# EAGLE design Teaching_instrument_mother_board_v4 (EAGLE 9.6.2)
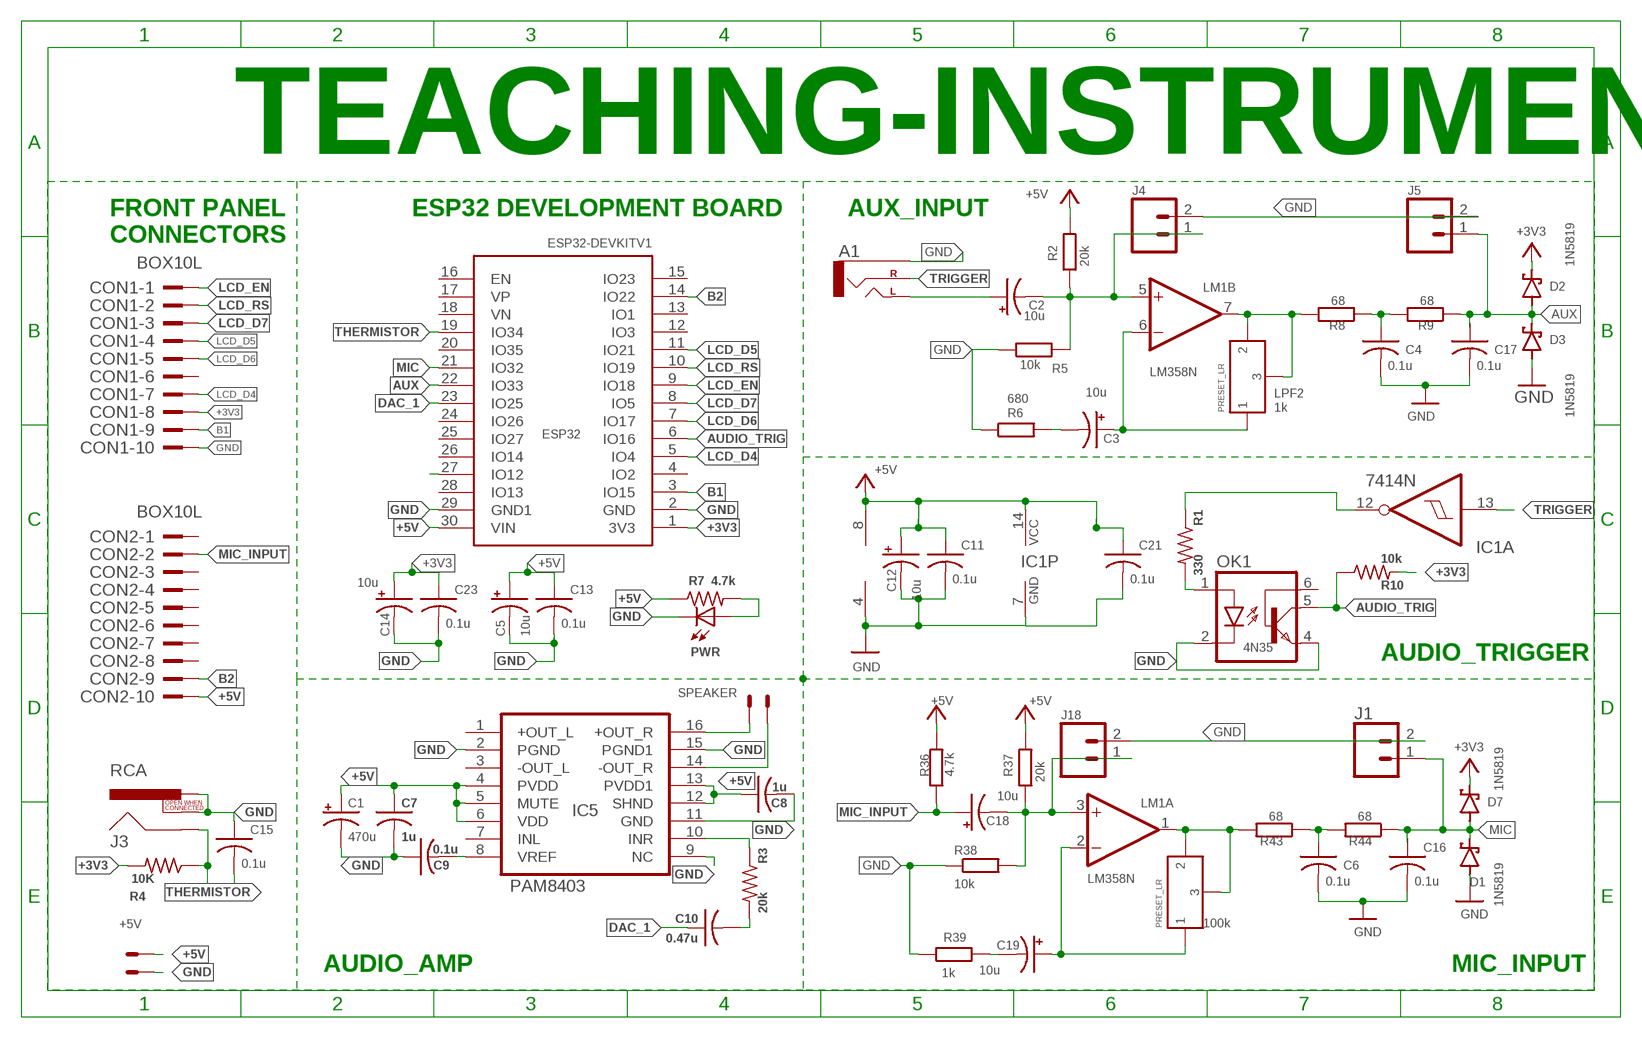
[diagram p0: schematic, sheet 1]

## Parts
100K  PRESET_LR  [PRESET_LR]
A1  CEDT_JANUARY_2015_V5_AUDIO-JACKPTH  [CEDT_JANUARY_2015_V5_AUDIO-JACK]
C1  470u  CPOL-USE5-10.5  [E5-10,5]
C2  10u  CPOL-USE2.5-5  [E2,5-5]
C3  10u  CPOL-USE2.5-5  [E2,5-5]
C4  0.1u  C-US025-024X044  [C025-024X044]
C5  10u  CPOL-USE2.5-5  [E2,5-5]
C6  0.1u  C-US025-024X044  [C025-024X044]
C7  1u  CAP0805  [C0805]
C8  1u  CAP0805  [C0805]
C9  0.1u  CAP0805  [C0805]
C10  0.47u  CAP0603  [C0603]
C11  0.1u  C-US025-024X044  [C025-024X044]
C12  10u  CPOL-USE2.5-5  [E2,5-5]
C13  0.1u  C-US025-024X044  [C025-024X044]
C14  10u  CPOL-USE2.5-5  [E2,5-5]
C15  0.1u  C-US025-024X044  [C025-024X044]
C16  0.1u  C-US025-024X044  [C025-024X044]
C17  0.1u  C-US025-024X044  [C025-024X044]
C18  10u  CPOL-USE2.5-5  [E2,5-5]
C19  10u  CPOL-USE2.5-5  [E2,5-5]
C21  0.1u  C-US025-024X044  [C025-024X044]
C23  0.1u  C-US025-024X044  [C025-024X044]
CON1  BOX10L  [BOX10L]
CON2  BOX10L  [BOX10L]
D1  1N5819  1N5819-B  [DO41-7.6]
D2  1N5819  1N5819-B  [DO41-7.6]
D3  1N5819  1N5819-B  [DO41-7.6]
D7  1N5819  1N5819-B  [DO41-7.6]
ESP32  ESP32-DEVKITV1_ESP32DEVKITV1ESP32  [ESP32]
IC1  7414N  [DIL14]
IC5  PAM8403  [SOP-16]
J1  CONN_02  [1X02]
J3  RCA  [RCA]
J4  CONN_02  [1X02]
J5  CONN_02  [1X02]
J18  CONN_02  [1X02]
LM1  LM358N  [DIL08]
OK1  4N35  [DIL06]
PWR  LED3MM  [LED3MM]
R1  330  R-US_M0805  [M0805]
R2  20k  R-EU_0207/10  [0207/10]
R3  20k  R-US_0207/10  [0207/10]
R4  10K  R-US_0207/10  [0207/10]
R5  10k  R-EU_0207/10  [0207/10]
R6  680  R-EU_0207/10  [0207/10]
R7  4.7k  R-US_0207/10  [0207/10]
R8  68  R-EU_0207/10  [0207/10]
R9  68  R-EU_0207/10  [0207/10]
R10  10k  R-US_M0805  [M0805]
R36  4.7k  R-EU_0207/10  [0207/10]
R37  20k  R-EU_0207/10  [0207/10]
R38  10k  R-EU_0207/10  [0207/10]
R39  1k  R-EU_0207/10  [0207/10]
R43  68  R-EU_0207/10  [0207/10]
R44  68  R-EU_0207/10  [0207/10]
SPEAKER  SPEAKER  JST-XH-02-PIN-LONG-PAD  [JST-XH-02-PACKAGE-LONG-PAD]
U$3  PRESET_LR  [PRESET_LR]
X1  +5V  JST-XH-02-PIN-LONG-PAD  [JST-XH-02-PACKAGE-LONG-PAD]

## Nets
+3V3: C14.+ C23.1 CON1.8 D2.C D7.C ESP32.1(3V3) R4.2 R10.2
+5V [POWER]: C1.+ C5.+ C7.1 C8.1 C11.1 C12.+ C13.1 C21.1 CON2.10 ESP32.30(VIN) IC1.14(P:VCC) IC5.4(PVDD) IC5.5(MUTE) IC5.6(VDD) IC5.12(SHND) IC5.13(PVDD1) LM1.8(P:V+) R2.2 R7.1 R36.2 R37.2 X1.2
ADC_6: ESP32.27(IO12)
AUDIO_TRIG: ESP32.6(IO16) OK1.5(COL) R10.1
AUX: C17.1 D2.A D3.C ESP32.22(IO33) J5.1 R9.1
B1: CON1.9 ESP32.3(IO15)
B2: CON2.9 ESP32.14(IO22)
DAC_1: C10.1 ESP32.23(IO25)
GND: A1.SLEEVE C1.- C4.2 C5.- C6.2 C7.2 C8.2 C9.1 C11.2 C12.- C13.2 C14.- C15.1 C16.2 C17.2 C21.2 C23.2 CON1.10 D1.A D3.A ESP32.2(GND) ESP32.29(GND1) IC1.7(P:GND) IC5.2(PGND) IC5.9(NC) IC5.11(GND) IC5.15(PGND1) J1.2 J3.PIN J3.SWITCH J4.2 J5.2 J18.2 LM1.4(P:V-) OK1.2(C) OK1.4(EMI) PWR.K(C) R5.1 R6.1 R38.1 R39.1 X1.1
LCD_D4: CON1.7 ESP32.5(IO4)
LCD_D5: CON1.4 ESP32.11(IO21)
LCD_D6: CON1.5 ESP32.7(IO17)
LCD_D7: CON1.3 ESP32.8(IO5)
LCD_EN: CON1.1 ESP32.9(IO18)
LCD_RS: CON1.2 ESP32.10(IO19)
LPF1: 100K.P$2 100K.P$3 LM1.1(A:OUT) R43.2
LPF2: LM1.7(B:OUT) R8.2 U$3.P$2 U$3.P$3
MIC: C16.1 D1.C D7.A ESP32.21(IO32) J1.1 R44.1
MIC_INPUT: C18.+ CON2.2 R36.1
N$1: IC5.16(+OUT_R) SPEAKER.2
N$2: 100K.P$1 C19.+ LM1.2(A:-IN)
N$3: A1.TIP(LEFT) C2.+
N$4: OK1.1(A) R1.2
N$5: IC5.14(-OUT_R) SPEAKER.1
N$6: C3.- R6.2
N$7: C9.2 IC5.8(VREF)
N$8: C10.2 R3.2
N$9: C2.- J4.1 LM1.5(B:+IN) R2.1 R5.2
N$10: C3.+ LM1.6(B:-IN) U$3.P$1
N$11: IC1.12(A:O) R1.1
N$12: C4.1 R8.1 R9.2
N$29: IC5.10(INR) R3.1
N$34: C6.1 R43.1 R44.2
N$38: PWR.A R7.2
N$49: C19.- R39.2
THERMISTOR: C15.2 ESP32.19(IO34) J3.SHELL R4.1
TRIGGER: A1.RING(RIGHT) IC1.13(A:I)
V3: C18.- J18.1 LM1.3(A:+IN) R37.1 R38.2
Unconnected: CON1.6 CON2.1 CON2.3 CON2.4 CON2.5 CON2.6 CON2.7 CON2.8 ESP32.4(IO2) ESP32.12(IO3) ESP32.13(IO1) ESP32.15(IO23) ESP32.16(EN) ESP32.17(VP) ESP32.18(VN) ESP32.20(IO35) ESP32.24(IO26) ESP32.25(IO27) ESP32.26(IO14) ESP32.28(IO13) IC1.1(D:I) IC1.2(D:O) IC1.3(E:I) IC1.4(E:O) IC1.5(F:I) IC1.6(F:O) IC1.8(C:O) IC1.9(C:I) IC1.10(B:O) IC1.11(B:I) IC5.1(+OUT_L) IC5.3(-OUT_L) IC5.7(INL) OK1.6(BAS)

## Notes on the sheet
- TEACHING-INSTRUMENT
- ESP32 DEVELOPMENT BOARD | AUX_INPUT
- FRONT PANEL 
  CONNECTORS
- 1k
- AUDIO_TRIGGER
- 100k
- AUDIO_AMP | MIC_INPUT

## Library data of the parts
100K U$3 = CEDT_JANUARY_2015_v5:PRESET_LR
A1 = aux-connector:CEDT_JANUARY_2015_V5_AUDIO-JACK: 3.5mm Audio Jack Simple 3.5mm common PCB mount audio jack. SKU: PRT-08032
C1-C3 C5 C12 C14 C18 C19 = rcl:CPOL-US: POLARIZED CAPACITOR, American symbol; SPICEPREFIX: C
C4 C6 C11 C13 C15-C17 C21 C23 = adafruit:C-US: CAPACITOR, American symbol
C7-C10 = CEDT_JANUARY_2015_v5:CAP
CON1 CON2 = CEDT_JANUARY_2015_v5:BOX10: 3M (TM) Pak 100 4-Wall Header Source: 3M
D1-D3 D7 = diode:1N581*: 1.0A SCHOTTKY BARRIER RECTIFIER Source: http://www.diodes.com/datasheets/ds23001.pdf
ESP32 = tw_ind:ESP32-DEVKITV1_ESP32DEVKITV1
IC1 = 74xx-eu:74*14: Hex schmitt trigger INVERTER
IC5 = PAM8403:PAM8403: Dual channel audio amplifier IC - PAM8403
J1 J4 J5 J18 = SparkFun-Connectors:CONN_02: Multi connection point. Often used as Generic Header-pin footprint for 0.1 inch spaced/style header connections On any of the 0.1 inch spaced packages, you can populate with these: Break Away Headers - Straight <https://www.sparkfun.com/products/116> (PRT-00116) Break Away Male Headers - Right Angle <https://www.sparkfun.com/products/553> (PRT-00553) Female Headers <https://www.sparkfun.com/products/115> (PRT-00115) Break Away Headers - Machine Pin <https://www.sparkfun.com/products/117> (PRT-00117) Break Away Female Headers - Swiss Machine Pin <https://www.sparkfun.com/products/743> (PRT-00743) For SCREWTERMINALS and SPRING TERMINALS visit here: Screw Terimnals on SparkFun.com <https://www.sparkfun.com/search/results?term=Screw+Terminals> (5mm/3.5mm/2.54mm spacing) This device is also useful as a general connection point to wire up your design to another part of your project. Our various solder wires solder well into these plated through hole pads. Hook-Up Wire - Assortment (Stranded, 22 AWG) <https://www.sparkfun.com/products/11375> (PRT-11375) Hook-Up Wire - Assortment (Solid Core, 22 AWG) <https://www.sparkfun.com/products/11367> (PRT-11367) View the entire wire category on our website here <https://www.sparkfun.com/categories/141> Special notes: Molex polarized connector foot print use with: PRT-08233 with associated crimp pins and housings. 2.54_SCREWTERM for use with PRT-10571. 3.5mm Screw Terminal footprints for PRT-08084 5mm Screw Terminal footprints for use with PRT-08432
J3 = SparkFun-Connectors:RCA: RCA Jack connector This is a right angle RCA jack connecotr. Commonly used for video or audio. Here is the connector we sell at SparkFun: RCA Jack <https://www.sparkfun.com/products/8631> (PRT-08631) Datasheet <http://www.sparkfun.com/datasheets/Prototyping/Connectors/RCA-Jack.pdf> It is not used on any active designs, however it was used on a couple retired products: RCA Jack Breakout [RETIRED] <https://www.sparkfun.com/products/8826> (PRT-08826) SparkFun On Screen Display Breakout - MAX7456 [RETIRED] <https://www.sparkfun.com/products/9168> (BOB-09168) You may also be interested in a cable: RCA Video Cable - 6' <https://www.sparkfun.com/products/11573> (CAB-11573); PROD_ID: CONN-09081; SF_ID: PRT-08631
LM1 = CEDT_JANUARY_2015_v5:LM358: OP AMP also LM158; LM258; LM2904 Source: http://cache.national.com/ds/LM/LM158.pdf
OK1 = optocoupler:4N35: MOTOROLA OPTO COUPLER; MF: FAIRCHILD SEMICONDUCTOR; MPN: 4N35; OC_FARNELL: 1328375; OC_NEWARK: 72K9946
PWR = adafruit:LED: LED OSRAM: - CHIPLED LG R971, LG N971, LY N971, LG Q971, LY Q971, LO R971, LY R971 LH N974, LH R974 LS Q976, LO Q976, LY Q976 LO Q996 - Hyper CHIPLED LW Q18S LB Q993, LB Q99A, LB R99A - SideLED LS A670, LO A670, LY A670, LG A670, LP A670 LB A673, LV A673, LT A673, LW A673 LH A674 LY A675 LS A676, LA A676, LO A676, LY A676, LW A676 LS A679, LY A679, LG A679 - Hyper Micro SIDELED® LS Y876, LA Y876, LO Y876, LY Y876 LT Y87S - SmartLED LW L88C, LW L88S LB L89C, LB L89S, LG L890 LS L89K, LO L89K, LY L89K LS L896, LA L896, LO L896, LY L896 - TOPLED LS T670, LO T670, LY T670, LG T670, LP T670 LSG T670, LSP T670, LSY T670, LOP T670, LYG T670 LG T671, LOG T671, LSG T671 LB T673, LV T673, LT T673, LW T673 LH T674 LS T676, LA T676, LO T676, LY T676, LB T676, LH T676, LSB T676, LW T676 LB T67C, LV T67C, LT T67C, LS T67K, LO T67K, LY T67K, LW E67C LS E67B, LA E67B, LO E67B, LY E67B, LB E67C, LV E67C, LT E67C LW T67C LS T679, LY T679, LG T679 LS T770, LO T770, LY T770, LG T770, LP T770 LB T773, LV T773, LT T773, LW T773 LH T774 LS E675, LA E675, LY E675, LS T675 LS T776, LA T776, LO T776, LY T776, LB T776 LHGB T686 LT T68C, LB T68C - Hyper Mini TOPLED® LB M676 - Mini TOPLED Santana® LG M470 LS M47K, LO M47K, LY M47K Source: http://www.osram.convergy.de/
R1 R3 R4 R10 = rcl:R-US_: RESISTOR, American symbol; SPICEPREFIX: R
R2 R5 R6 R8 R9 R36-R39 R43 R44 = rcl:R-EU_: RESISTOR, European symbol; SPICEPREFIX: R
R7 = rcl:R-US_: RESISTOR, American symbol
SPEAKER X1 = Rembrandt Electronics - JST XH Connectors v1-0:JST-XH-02-PIN: JST XH Connector 2 Pin Wire to board connector. Pitch: 2,54 mm, (0.100") Number of pins: 2 Created by Rembrandt Electronics www.rembrandtelectronics.com

## Net classes
0 default: width 0.508 mm
1 POWER: width 0.711 mm, drill 0.7 mm, clearance 0.25 mm

## Board
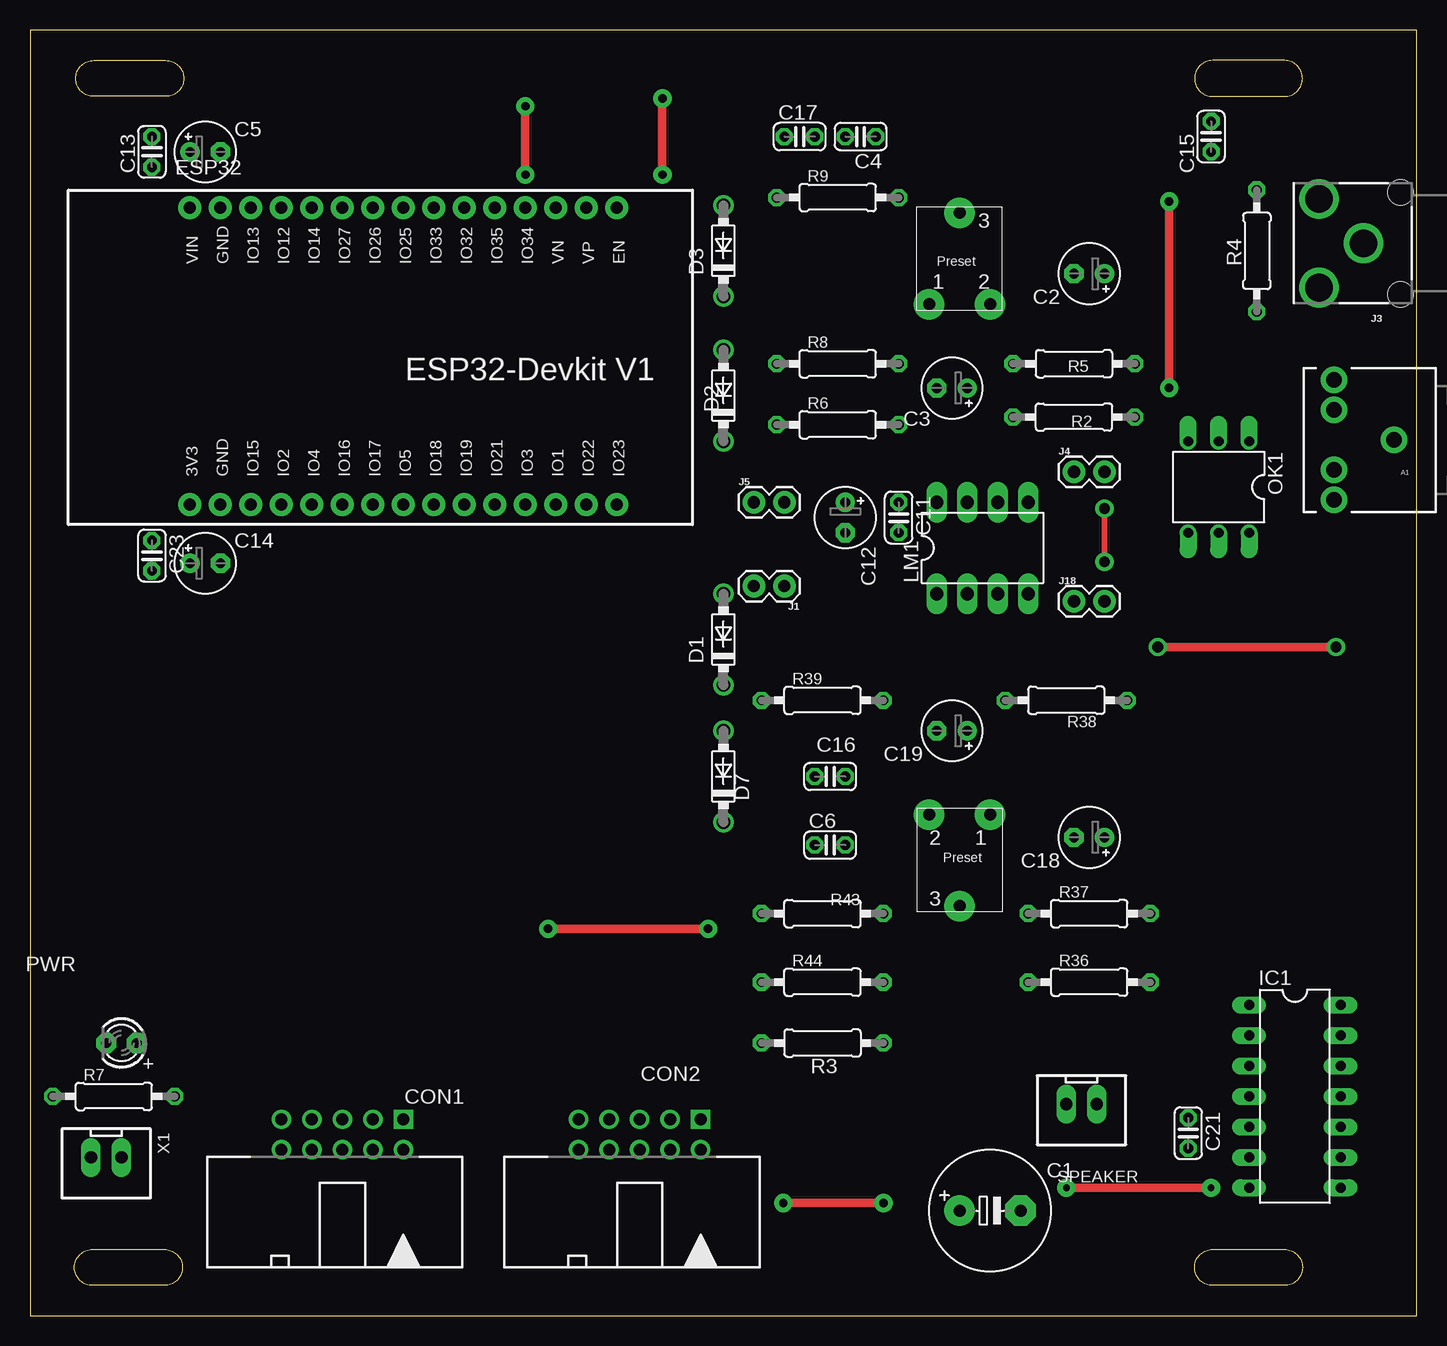
[diagram p1: board, top side]
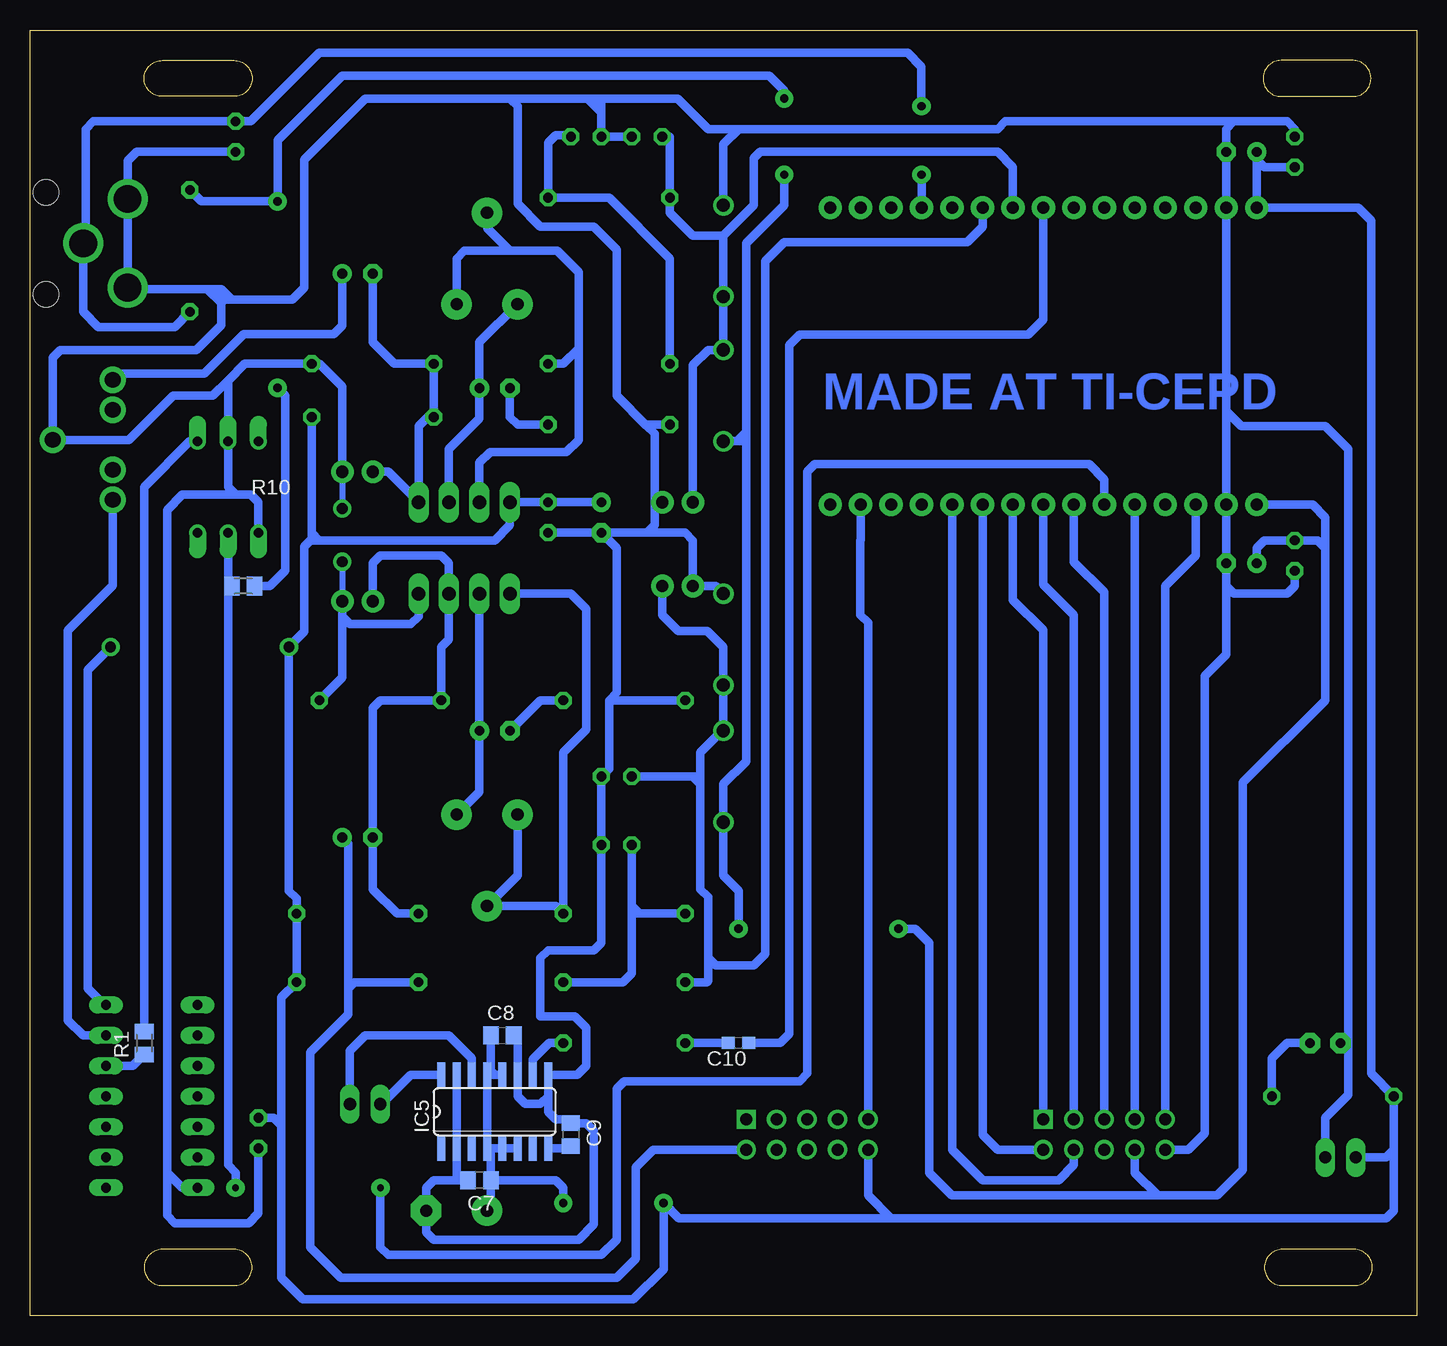
[diagram p2: board, bottom side, seen from below]

Size 115.56 x 107.2 mm. Coordinates in mm from the lower left corner, seen from the top.
Outline: 0,0 115.55,0 115.56,107.2 0.01,107.2 0,0
Outline: 5.31,104.66 11.31,104.66 arc-90 12.81,103.16 arc-90 11.31,101.66 5.31,101.66 arc-90 3.81,103.16 arc-90 5.31,104.66
Outline: 104.55,104.66 98.55,104.66 arc90 97.05,103.16 arc90 98.55,101.66 104.55,101.66 arc90 106.05,103.16 arc90 104.55,104.66
Outline: 11.2,2.54 5.2,2.54 arc-90 3.7,4.04 arc-90 5.2,5.54 11.2,5.54 arc-90 12.7,4.04 arc-90 11.2,2.54
Outline: 104.55,2.54 98.55,2.54 arc-90 97.05,4.04 arc-90 98.55,5.54 104.55,5.54 arc-90 106.05,4.04 arc-90 104.55,2.54
Copper layers (1*16): Top 0.035mm / dielectric 1.5mm / Bottom 0.035mm
Design rules "default *": minimum track width 6mil, minimum drill 0.35mm, track to track 16mil, track to pad 16mil, pad to pad 16mil, via to via 16mil, smd to smd 16mil, copper to edge 20mil, drill to drill 6mil, minimum pad ring 12mil, minimum via ring 12mil, stop-mask expansion 4mil, vias tented up to drill 0mil, thermal gap 10mil

### Footprints (pad centres in the part's own frame; a part is rotated, then mirrored left to right if it is on the bottom)
PRESET_LR = drill 1.016 pad 2.54: P$1 -2.54,-3.81; P$2 2.54,-3.81; P$3 0,3.81
CEDT_JANUARY_2015_V5_AUDIO-JACK = drill 1.3 pad 2.184: RING 5,5; RSH 5,2.5; SLEEVE 0,0; TIP 5,-5; TSH 5,-2.5
E5-10,5 = drill 1.016 pad 2.54: + -2.54,0 | drill 1.016 pad 2.54 octagon: - 2.54,0
E2,5-5 = drill 0.813 pad 1.6: + -1.27,0 | drill 0.813 pad 1.6 octagon: - 1.27,0
C025-024X044 = drill 0.813 pad 1.422 octagon: 1 -1.27,0; 2 1.27,0
C0805 = smd 1.3 x 1.5: 1 -0.95,0; 2 0.95,0
C0603 = smd 1.1 x 1: 1 -0.85,0; 2 0.85,0
BOX10L = drill 1 pad 1.422 square: 1 -5.08,-1.27 | drill 1 pad 1.422: 2 -5.08,1.27; 3 -2.54,-1.27; 4 -2.54,1.27; 5 0,-1.27; 6 0,1.27; 7 2.54,-1.27; 8 2.54,1.27; 9 5.08,-1.27; 10 5.08,1.27
DO41-7.6 = drill 1.1 pad 1.7: A 3.81,0; C -3.81,0
ESP32 = drill 1 pad 1.93: 1 -15.25,-13.54; 2 -12.71,-13.54; 3 -10.17,-13.54; 4 -7.63,-13.54; 5 -5.09,-13.54; 6 -2.55,-13.54; 7 -0.01,-13.54; 8 2.53,-13.54; 9 5.07,-13.54; 10 7.61,-13.54; 11 10.15,-13.54; 12 12.69,-13.54; 13 15.23,-13.54; 14 17.77,-13.54; 15 20.31,-13.54; 16 20.31,11.23; 17 17.77,11.23; 18 15.23,11.23; 19 12.69,11.23; 20 10.15,11.23; 21 7.61,11.23; 22 5.07,11.23; 23 2.53,11.23; 24 -0.01,11.23; 25 -2.55,11.23; 26 -5.09,11.23; 27 -7.63,11.23; 28 -10.17,11.23; 29 -12.71,11.23; 30 -15.25,11.23
DIL14 = drill 0.813 long: 1 -7.62,-3.81; 2 -5.08,-3.81; 3 -2.54,-3.81; 4 0,-3.81; 5 2.54,-3.81; 6 5.08,-3.81; 7 7.62,-3.81; 8 7.62,3.81; 9 5.08,3.81; 10 2.54,3.81; 11 0,3.81; 12 -2.54,3.81; 13 -5.08,3.81; 14 -7.62,3.81
SOP-16 = smd 0.66 x 2.032: 1 -4.445,-3.073; 2 -3.175,-3.073; 3 -1.905,-3.073; 4 -0.635,-3.073; 5 0.635,-3.073; 6 1.905,-3.073; 7 3.175,-3.073; 8 4.445,-3.073; 9 4.445,3.073; 10 3.175,3.073; 11 1.905,3.073; 12 0.635,3.073; 13 -0.635,3.073; 14 -1.905,3.073; 15 -3.175,3.073; 16 -4.445,3.073
1X02 = drill 1.016 pad 1.88: 1 0,0; 2 2.54,0
RCA = drill 2.3: PIN 3.7,3.7; SHELL 0,0; SWITCH 3.7,-3.7 | hole 2.1: -3.1,4.25; -3.1,-4.25
DIL08 = drill 1.118 long: 1 -3.81,-3.81; 2 -1.27,-3.81; 3 1.27,-3.81; 4 3.81,-3.81; 5 3.81,3.81; 6 1.27,3.81; 7 -1.27,3.81; 8 -3.81,3.81
DIL06 = drill 0.813 offset: 1 -2.54,-3.81; 2 0,-3.81; 3 2.54,-3.81; 4 2.54,3.81; 5 0,3.81; 6 -2.54,3.81
LED3MM = drill 0.813 pad 1.676 octagon: A -1.27,0; K 1.27,0
M0805 = smd 1.3 x 1.6: 1 -0.95,0; 2 0.95,0
0207/10 = drill 0.813 octagon: 1 -5.08,0; 2 5.08,0
JST-XH-02-PACKAGE-LONG-PAD = drill 1.016 long: 1 -1.27,0; 2 1.27,0

### Placement (x,y rotation side)
100K  77.47,37.98 180 top
A1  113.67,73.03 180 top
C1  80.01,8.78 0 top
C2  88.27,86.88 180 top
C3  76.83,77.36 180 top
C4  69.22,98.31 180 top
C5  14.61,97.04 0 top
C6  66.67,39.26 0 top
C7  78.11,11.31 180 bottom
C8  76.2,23.38 0 bottom
C9  70.48,15.12 270 bottom
C10  56.52,22.75 180 bottom
C11  72.39,66.56 270 top
C12  67.94,66.56 270 top
C13  10.16,97.04 90 top
C14  14.61,62.75 0 top
C15  98.42,98.31 90 top
C16  66.67,44.97 0 top
C17  64.14,98.31 0 top
C18  88.27,39.89 180 top
C19  76.83,48.78 180 top
C21  96.52,15.24 270 top
C23  10.16,63.38 270 top
CON1  26.04,15.12 180 top
CON2  50.8,15.12 180 top
D1  57.78,56.4 90 top
D2  57.78,76.72 90 top
D3  57.78,88.78 90 top
D7  57.78,44.97 90 top
ESP32  28.57,81.17 0 top
IC1  105.41,18.3 270 top
IC5  76.83,17.03 0 bottom
J1  62.87,60.84 180 top
J3  111.12,89.42 180 top
J4  87,70.37 0 top
J5  60.33,67.83 0 top
J18  87,59.58 0 top
LM1  79.38,64.02 0 top
OK1  99.06,69.1 180 top
PWR  7.62,22.75 180 top
R1  106.05,22.75 90 bottom
R2  87,74.93 0 top
R3  66.04,22.75 180 top
R4  102.23,88.78 90 top
R5  87,79.38 180 top
R6  67.31,74.3 0 top
R7  6.99,18.3 0 top
R8  67.31,79.38 0 top
R9  67.31,93.23 0 top
R10  97.79,60.84 0 bottom
R36  88.27,27.82 0 top
R37  88.27,33.54 0 top
R38  86.36,51.32 180 top
R39  66.04,51.32 0 top
R43  66.04,33.54 0 top
R44  66.04,27.82 0 top
SPEAKER  87.63,17.66 180 top
U$3  77.47,88.15 0 top
X1  6.35,13.22 180 top

### Tracks (layer width: path | path; a pad name or v marks a point on that pad's centre or on a via)
+3V3  (via drill 0.7 pad 1.52)
  Top 0.711: v52.7,101.48 v52.7,95.14 | v56.52,32.27 v43.18,32.27 | v94.93,92.91 v94.93,77.36
  Bottom 0.711: 55.88,72.91 55.88,46.24 57.78,44.34 D7.C 57.78,36.72 56.52,35.45 v56.52,32.27 | C14.+ 13.34,64.02 12.7,64.66 C23.1 8.26,64.66 7.62,64.02 | 21.59,10.04 23.5,11.95 CON1.8 | 7.62,64.02 7.62,51.32 14.49,44.45 14.49,12.18 16.62,10.04 21.59,10.04 | 21.59,10.04 38.73,10.04 40.64,11.95 40.64,31.11 41.8,32.27 v43.18,32.27 | v52.7,101.48 52.7,102.12 53.98,103.39 89.53,103.39 94.93,97.99 v94.93,92.91 101.28,92.91 R4.2 | v52.7,95.14 52.7,92.59 55.88,89.42 55.88,73.66 | 55.88,73.66 55.88,72.91 | 7.62,64.02 7.62,66.56 8.69,67.62 ESP32.1 | 55.88,72.91 D2.C 56.63,72.91 55.88,73.66 | v94.93,77.36 94.3,76.72 94.3,62.12 95.57,60.84 R10.2
+5V  (via drill 0.7 pad 1.52, 0.89 pad 1.52)
  Top 0.711: v62.77,9.41 v71.12,9.41 | v108.84,55.77 v93.98,55.77
  Bottom 0.711: IC5.4 IC5.13 76.83,20.1 | IC5.6 IC5.5 IC5.4 | C7.1 77.16,13.64 IC5.4 | IC5.12 76.83,20.1 | R2.2 92.08,65.29 | 92.08,65.29 92.08,64.66 | 91.44,64.66 76.83,64.66 75.56,65.92 LM1.8 C11.1 C12.+ | 91.44,64.66 92.08,64.66 | 12.9,92.39 ESP32.30 | 12.9,92.39 4.88,92.39 3.81,91.33 3.81,20.2 R7.1 1.91,13.86 | X1.2 2.54,13.22 1.91,13.86 | 43.81,8.14 2.54,8.14 1.91,8.78 1.91,13.86 | 43.81,8.14 45.72,10.04 CON2.10 | v71.12,9.41 71.12,10.68 71.75,11.31 C7.1 | 94.61,15.88 94.61,26.55 R36.2 R37.2 93.34,34.81 93.98,35.45 v93.98,55.77 92.71,57.03 92.71,64.14 92.19,64.66 92.08,64.66 | C13.1 12.7,95.77 13.34,96.41 C5.+ 13.34,92.83 12.9,92.39 | C8.1 77.15,20.42 76.83,20.1 | v108.84,55.77 110.74,53.86 110.74,27.3 109.36,25.92 IC1.14 | 43.81,8.14 61.5,8.14 v62.77,9.41 62.77,3.91 65.3,1.37 92.81,1.37 94.61,3.17 94.61,15.88 | C1.+ 77.16,9.09 C7.1 | C21.1 95.25,16.51 94.61,15.88 | 92.08,65.29 91.44,64.66
AUDIO_TRIG  (via drill 0.55 pad 1.52)
  Top 0.711: v86.36,10.68 v98.42,10.68
  Bottom 0.711: ESP32.6 26.02,69.72 27.3,71 50.16,71 50.8,70.37 50.8,20.2 51.44,19.57 66.04,19.57 66.67,18.93 66.67,6.35 67.94,5.08 85.72,5.08 86.36,5.71 v86.36,10.68 | OK1.5 99.06,60.52 | 99.06,60.52 99.06,12.59 98.42,11.95 v98.42,10.68 | R10.1 99.06,60.52
AUX
  Bottom 0.711: C17.1 62.23,98.31 R9.1 62.23,91.96 60.33,90.06 57.78,90.06 | 57.78,90.06 D3.C D2.A 59.05,80.53 60.33,79.26 J5.1 | ESP32.22 33.65,95.76 34.92,97.04 54.73,97.04 55.24,96.52 55.24,92.59 57.78,90.06
B1
  Bottom 0.711: ESP32.3 18.41,63.4 20.95,60.84 CON1.9
B2
  Bottom 0.711: ESP32.14 46.34,64.67 46.35,64.66 46.35,58.42 45.72,57.78 CON2.9
DAC_1
  Bottom 0.711: ESP32.23 31.11,92.39 31.11,83.07 32.38,81.8 51.44,81.8 52.28,80.95 52.28,23.5 53.03,22.75 C10.1
GND  (via drill 0.89 pad 1.52)
  Top 0.508: v89.53,67.31 v89.53,62.87
  Bottom 0.508: J4.2 v89.53,67.31 | v89.53,62.87 J18.2
  Bottom 0.711: IC5.15 IC5.2 80.01,11.63 79.69,11.31 C7.2 81.92,11.31 82.55,10.68 C1.- 82.55,6.99 81.92,6.35 69.85,6.35 68.58,7.62 68.58,15.44 69.22,16.07 C9.1 70.81,16.39 71.75,16.39 72.39,17.03 72.39,18.3 | J4.2 89.53,77.47 91.44,79.38 R5.1 97.67,79.38 99.06,77.99 | C11.2 C12.- | 63.5,68.47 63.5,73.55 64.19,74.24 | J5.2 63.5,68.47 | 75.56,101.48 74.93,100.85 74.93,92.71 73.03,90.81 68.58,90.81 66.67,88.9 66.67,76.72 64.19,74.24 | 75.56,101.48 69.1,101.48 | 69.1,101.48 67.94,101.48 | 67.94,101.48 61.59,101.48 59.05,98.94 56.52,98.94 | 67.94,100.33 C4.2 C17.2 | 67.94,100.33 67.94,101.48 | C12.- 64.14,65.29 | 64.14,65.29 63.5,65.92 63.5,68.47 | J18.2 89.53,58.3 | 89.53,58.3 88.9,57.67 83.82,57.67 83.19,58.3 LM1.4 | 89.53,58.3 89.53,53.23 R38.1 | R39.1 67.31,51.32 | 67.31,51.32 67.31,45.6 C16.2 C6.2 67.94,31.11 68.58,30.48 72.39,30.48 73.03,29.84 73.03,24.96 70.17,24.96 69.22,24.02 69.22,20.84 69.95,20.1 IC5.9 72.39,18.3 | 64.14,65.29 60.96,65.29 60.33,64.66 J1.2 58.42,60.84 D1.A | D3.A 57.78,97.67 56.52,98.94 | 56.52,98.94 34.92,98.94 34.29,99.58 15.24,99.58 | 15.87,75.44 ESP32.29 15.88,92.41 C5.- 15.88,98.94 15.24,99.58 | 15.87,75.44 ESP32.2 15.87,62.76 C14.- 15.88,60.84 | C23.2 10.16,60.84 10.79,60.21 15.24,60.21 15.88,60.84 | 5.71,23.38 5.71,72.28 7.62,74.18 14.61,74.18 15.87,75.44 | C13.2 10.16,98.94 10.79,99.58 15.24,99.58 | 5.71,23.38 5.71,18.41 7.62,16.51 X1.1 | 72.39,18.3 73.03,17.66 74.3,17.66 74.93,18.3 IC5.11 74.93,23.06 C8.2 | 75.56,101.48 87.63,101.48 92.71,96.41 92.71,85.72 93.72,84.72 98.74,84.72 | 99.06,77.99 100.33,76.72 103.62,76.72 107.31,73.03 A1.SLEEVE 113.67,79.89 113.03,80.53 101.72,80.53 99.64,82.61 99.64,84.45
  Bottom 0.711: 99.06,77.99 OK1.2 99.06,69.1 98.42,68.47 | 98.42,68.47 97.16,68.47 96.52,67.83 OK1.4 | 98.42,68.47 102.87,68.47 104.14,67.19 104.14,11.95 | 104.14,11.95 102.87,10.68 IC1.7 | C12.- 66.67,64.02 66.67,51.95 67.31,51.32 | 64.19,74.24 64.14,74.3 R6.1 | C15.1 106.68,97.04 107.42,96.3 J3.SWITCH J3.PIN 107.31,85.61 100.79,85.61 | 99.64,85.61 100.79,85.61 | PWR.K 5.71,23.38 | 15.88,60.84 15.88,55.13 17.66,53.34 17.66,15.24 19.05,13.86 CON1.10 | 67.94,100.33 69.1,101.48 | 98.74,84.72 99.64,85.61 | 99.64,84.45 99.64,85.61 | 99.64,84.45 100.79,85.61 | 98.74,84.72 99.38,84.72 99.64,84.45 | 104.14,11.95 104.14,8.37 103.5,7.73 97.34,7.73 96.52,8.55 C21.2
LCD_D4
  Bottom 0.711: ESP32.5 23.48,64.35 23.5,64.34 CON1.7
LCD_D5
  Bottom 0.711: ESP32.11 38.73,13.86 36.19,11.31 29.84,11.31 28.57,12.59 CON1.4
LCD_D6
  Bottom 0.711: ESP32.7 28.57,62.87 26.04,60.34 CON1.5
LCD_D7
  Bottom 0.711: ESP32.8 31.11,63.81 31.11,63.8 31.11,60.96 28.57,58.42 CON1.3
LCD_EN
  Bottom 0.711: ESP32.9 33.65,59.69 31.11,57.16 CON1.1
LCD_RS
  Bottom 0.711: CON1.2 34.92,13.86 36.19,15.12 ESP32.10
LPF1
  Bottom 0.711: LM1.1 70.48,60.21 69.22,58.94 69.22,48.9 71.12,46.99 R43.2 71.75,34.17 100K.P$3 74.93,36.72 100K.P$2
LPF2
  Bottom 0.711: U$3.P$2 80.01,88.15 79.38,88.78 75.56,88.78 | U$3.P$3 77.47,90.69 75.56,88.78 | 69.85,80.64 69.85,73.03 70.86,72.02 77.21,72.02 78.11,71.12 LM1.7 | R8.2 71.12,79.38 69.85,80.64 | 75.56,88.78 71.64,88.78 69.85,87 69.85,80.64
MIC
  Bottom 0.711: ESP32.21 36.19,90.79 37.47,89.51 52.7,89.51 54.28,87.93 54.28,30.18 55.24,29.21 58.42,29.21 59.05,29.84 | 59.69,45.09 59.69,46.99 57.9,48.78 D7.A D1.C 57.78,55.77 59.11,57.09 61.54,57.09 62.87,58.42 J1.1 | 59.69,45.09 59.8,44.97 60.33,44.97 | 60.33,44.97 C16.1 | 59.05,29.84 59.05,34.92 59.69,35.56 59.69,44.34 | 59.69,45.09 59.69,44.34 | 60.33,44.97 59.69,44.34 | R44.1 59.17,27.82 59.05,27.94 59.05,29.84
MIC_INPUT
  Bottom 0.711: R36.1 88.53,27.82 89.05,27.3 | C18.+ 89.05,39.4 89.05,27.3 | 89.05,27.3 89.05,25.14 92.22,21.96 92.22,5.71 89.68,3.17 66.67,3.17 65.09,4.76 65.09,12.38 63.62,13.86 CON2.2
N$1
  Bottom 0.711: IC5.16 83.82,20.1 86.26,17.66 SPEAKER.2
N$2
  Bottom 0.711: LM1.2 C19.+ 78.11,43.7 100K.P$1
N$3
  Bottom 0.711: C2.+ 89.53,82.55 90.23,81.86 97.73,81.86 101.05,78.55 108.03,78.55 108.55,78.03 A1.TIP
N$4
  Bottom 0.711: R1.2 106.05,69.1 102.23,72.91 OK1.1
N$5
  Bottom 0.711: IC5.14 78.74,21.48 80.64,23.38 87.63,23.38 88.9,22.11 SPEAKER.1
N$6
  Bottom 0.711: C3.- 75.56,74.93 74.93,74.3 R6.2
N$7
  Bottom 0.711: C9.2 70.48,13.96 IC5.8
N$8
  Bottom 0.711: C10.2 R3.2
N$9
  Bottom 0.711: J4.1 85.72,70.37 LM1.5 83.19,74.18 82.44,74.93 R2.1 R5.2 85.2,79.38 87,81.17 C2.-
N$10
  Bottom 0.711: LM1.6 80.64,72.28 78.11,74.81 C3.+ 78.11,81.17 U$3.P$1
N$11
  Bottom 0.711: R1.1 107,20.84 IC1.12
N$12
  Bottom 0.711: R8.1 62.23,88.15 67.31,93.23 R9.2 72.39,97.79 71.75,98.42 70.6,98.42 C4.1
N$29
  Bottom 0.711: IC5.10 73.66,21.37 72.29,22.75 R3.1
N$34
  Bottom 0.711: C6.1 65.41,34.92 65.41,34.17 | 65.41,34.17 65.41,33.54 | 65.41,33.54 65.41,28.57 66.16,27.82 R44.2 | R43.1 64.77,33.54 | 64.77,33.54 65.41,33.54 | 65.41,34.17 64.77,33.54
N$38
  Bottom 0.711: PWR.A 10.79,22.75 12.06,21.48 R7.2
N$49
  Bottom 0.711: C19.- 73.03,51.32 R39.2
THERMISTOR  (via drill 0.7 pad 1.52)
  Top 0.711: v41.27,100.85 v41.27,95.14
  Bottom 0.711: R4.1 103.5,82.44 109.86,82.44 111.12,83.7 J3.SHELL 110.92,89.62 110.92,98.94 110.29,99.58 C15.2 97.16,99.58 91.44,105.3 42.43,105.3 41.27,104.14 v41.27,100.85 | ESP32.19 41.27,95.12 v41.27,95.14
TRIGGER
  Bottom 0.508: A1.RING 108.67,67.91
  Bottom 0.711: IC1.13 111.12,23.38 112.39,24.65 112.39,57.15 108.67,60.88 108.67,67.91
V3
  Bottom 0.711: J18.1 87,62.75 86.36,63.38 81.28,63.38 80.64,62.75 LM1.3 80.64,56.4 81.28,55.77 R38.2 86.36,51.32 87,50.69 C18.- 87,35.56 84.97,33.54 R37.1

### Text on the board
Bottom: MADE AT TI-CEPD